# Altium schematic sheet reverse_protection.SchDoc: Reverse Protection
size A4; Organization: OSURC Mars Rover; DocumentNumber: 7; Revision: 1; SheetNumber: 7; SheetTotal: 12
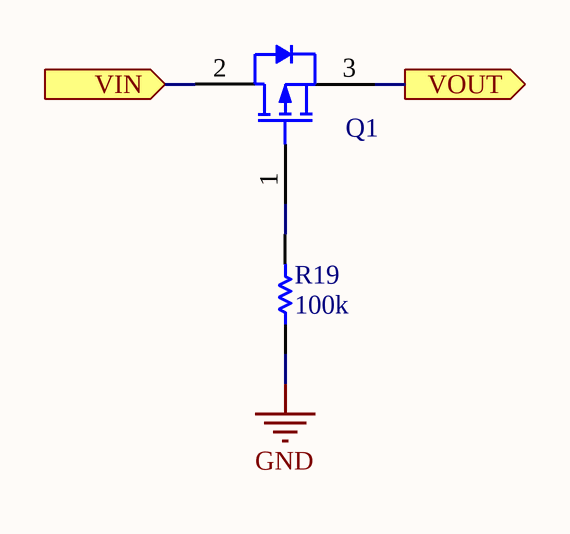
[diagram p0: reverse_protection.SchDoc]

## Parts
Q1  Infineon IPD90P04P405ATMA1  [PCB-n8uhnm53xyssvg7v0f21-1]  (value not drawn)
R19  100k  [RESC1609X50X30LL10T20]

## Ports
VIN (in), VOUT (out)

## Nets
GND: R19.1
VIN: Q1.2(D) ; port VIN
VOUT: Q1.3(S) ; port VOUT
NetQ1_1: Q1.1(G) R19.2

## Notes on the sheet
- Title
- Size:
- Date:
- A4
- Engineer:
- Time:
- Sheet
- Revision:
- of
- File:

## Library data of the parts
Q1 = CMP-b5fa7db8f8eb6a3d-1: Single P-Channel 40 V 4.7 mOhm 118 nC OptiMOS Power Mosfet - TO-252-3; Lead-Free Status: Lead Free; Octopart URL: http://octopart.com/ipd90p04p405atma1-infineon-21522551; Manufacturer Part Number: IPD90P04P405ATMA1; Polarity: P-Channel; RoHS: Compliant; Mounting Style: Surface Mount; OctopartID: b5fa7db8f8eb6a3d
R19 = CMP-16231689-4: RES SMD 100K OHM 1% 1/10W 0603; Voltage Rating (DC): 75.0 V; Resistance: 100000.0 Ω; Lead-Free Status: Lead Free; Power Rating: 0.1 W; Temperature Coefficient: 100.0 ppm/°C; RoHS: Compliant; Case/Package: 0603; Size-Width: 0.00085 m; Mounting Style: Surface Mount; OctopartID: e5812ed694933a46; Octopart Url: https://octopart.com/crcw0603100kfkea-vishay-39670900; Size-Length: 0.00155 m; Resistance Tolerance: ±1%; REACH SVHC Compliance: No SVHC; Size-Height: 0.00045 m; Number of Pins: 2